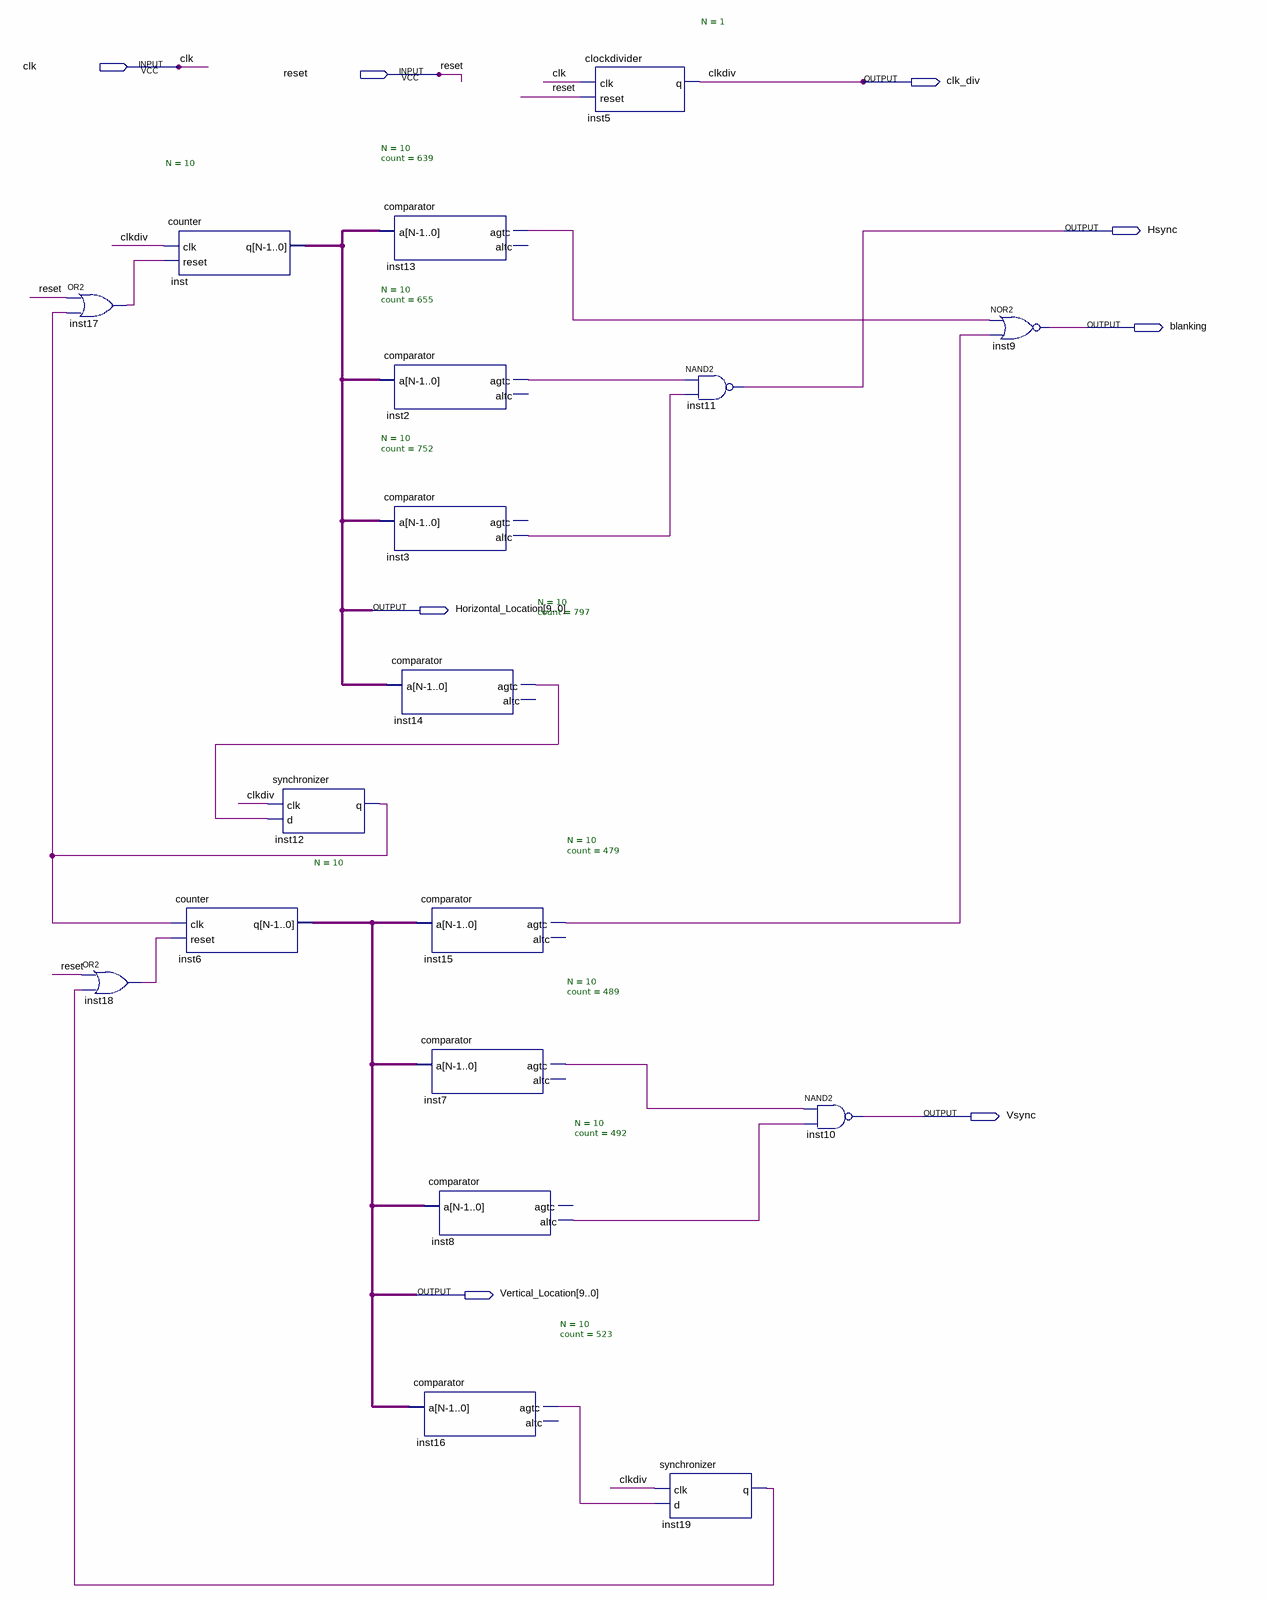
[diagram p0: schematic sheet]
// Quartus schematic Lab6.bdf as structural Verilog: 18 symbols, 8 pins
module Lab6 (
  input  clk,
  input  reset,
  output clk_div,
  output Hsync,
  output blanking,
  output [9:0] Horizontal_Location,
  output Vsync,
  output [9:0] Vertical_Location
);

  wire inst2_agtc, inst3_altc, inst7_agtc, inst8_altc, inst12_q, inst13_agtc, inst14_agtc, inst15_agtc,
       inst16_agtc, inst17_out, inst18_out, inst19_q;

  or inst17 (inst17_out, reset, inst12_q);
  or inst18 (inst18_out, reset, inst19_q);
  counter #(.N(10)) inst (.clk(clk_div), .reset(inst17_out), .q(Horizontal_Location));
  counter #(.N(10)) inst6 (.clk(inst12_q), .reset(inst18_out), .q(Vertical_Location));
  synchronizer inst12 (.clk(clk_div), .d(inst14_agtc), .q(inst12_q));
  comparator #(.N(10), .count(639)) inst13 (.a(Horizontal_Location), .agtc(inst13_agtc));  // open: altc
  comparator #(.N(10), .count(655)) inst2 (.a(Horizontal_Location), .agtc(inst2_agtc));  // open: altc
  comparator #(.N(10), .count(752)) inst3 (.a(Horizontal_Location), .altc(inst3_altc));  // open: agtc
  comparator #(.N(10), .count(797)) inst14 (.a(Horizontal_Location), .agtc(inst14_agtc));  // open: altc
  comparator #(.N(10), .count(523)) inst16 (.a(Vertical_Location), .agtc(inst16_agtc));  // open: altc
  comparator #(.N(10), .count(479)) inst15 (.a(Vertical_Location), .agtc(inst15_agtc));  // open: altc
  comparator #(.N(10), .count(489)) inst7 (.a(Vertical_Location), .agtc(inst7_agtc));  // open: altc
  comparator #(.N(10), .count(492)) inst8 (.a(Vertical_Location), .altc(inst8_altc));  // open: agtc
  clockdivider #(.N(1)) inst5 (.clk(clk), .reset(reset), .q(clk_div));
  nand inst11 (Hsync, inst2_agtc, inst3_altc);
  synchronizer inst19 (.clk(clk_div), .d(inst16_agtc), .q(inst19_q));
  nand inst10 (Vsync, inst7_agtc, inst8_altc);
  nor inst9 (blanking, inst13_agtc, inst15_agtc);

  // Other names for the same wires on the sheet: clkdiv = clk_div
endmodule
